# Altium schematic sheet 10_Power.SchDoc: Power (part 1 of 2)
size A3; Organization: Lime Microsystems; Address1: Surrey Tech Centre; Address2: Guildford GU2 7YG; Address3: Surrey; Address4: United Kingdom; Revision: v1.0; SheetNumber: 10; SheetTotal: 10
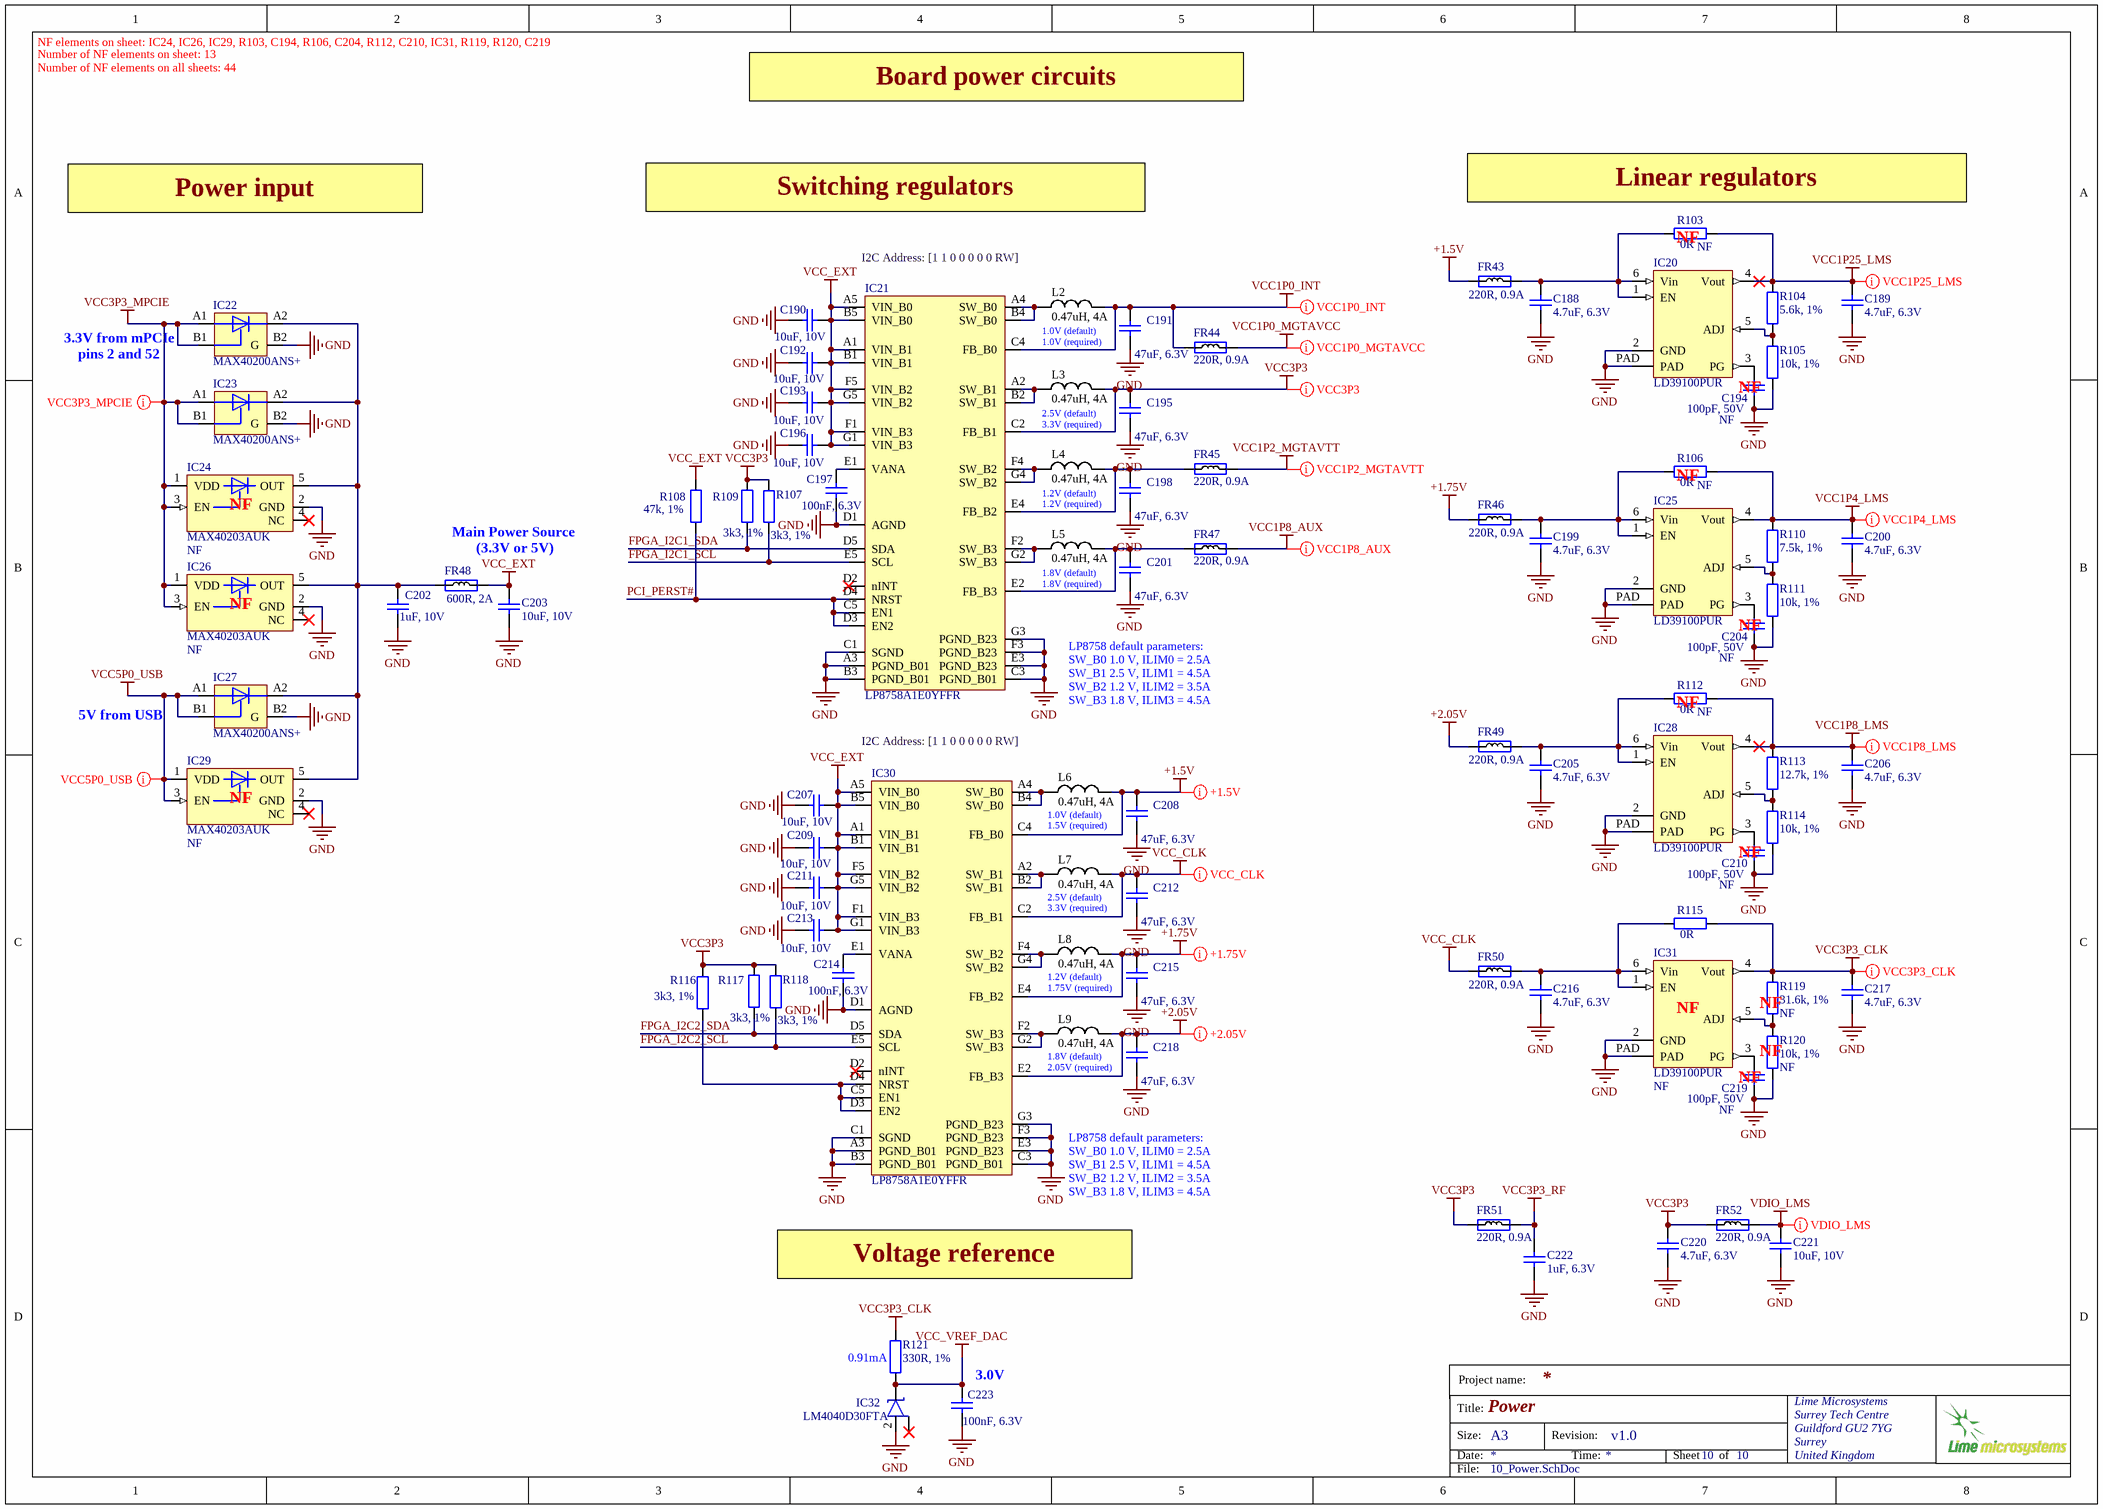
[diagram p0: 10_Power.SchDoc]

## Parts
C188  4.7uF, 6.3V  [CAP0402]
C189  4.7uF, 6.3V  [CAP0402]
C190  10uF, 10V  [CAP0603]
C191  47uF, 6.3V  [CAP0603]
C192  10uF, 10V  [CAP0603]
C193  10uF, 10V  [CAP0603]
C194  100pF, 50V  Assembly Info: NF  [CAP0201]
C195  47uF, 6.3V  [CAP0603]
C196  10uF, 10V  [CAP0603]
C197  100nF, 6.3V  [CAP0201]
C198  47uF, 6.3V  [CAP0603]
C199  4.7uF, 6.3V  [CAP0402]
C200  4.7uF, 6.3V  [CAP0402]
C201  47uF, 6.3V  [CAP0603]
C202  1uF, 10V  [CAP0402]
C203  10uF, 10V  [CAP0603]
C204  100pF, 50V  Assembly Info: NF  [CAP0201]
C205  4.7uF, 6.3V  [CAP0402]
C206  4.7uF, 6.3V  [CAP0402]
C207  10uF, 10V  [CAP0603]
C208  47uF, 6.3V  [CAP0603]
C209  10uF, 10V  [CAP0603]
C210  100pF, 50V  Assembly Info: NF  [CAP0201]
C211  10uF, 10V  [CAP0603]
C212  47uF, 6.3V  [CAP0603]
C213  10uF, 10V  [CAP0603]
C214  100nF, 6.3V  [CAP0201]
C215  47uF, 6.3V  [CAP0603]
C216  4.7uF, 6.3V  [CAP0402]
C217  4.7uF, 6.3V  [CAP0402]
C218  47uF, 6.3V  [CAP0603]
C219  100pF, 50V  Assembly Info: NF  [CAP0201]
C220  4.7uF, 6.3V  [CAP0402]
C221  10uF, 10V  [CAP0603]
C222  1uF, 6.3V  [CAP0201]
C223  100nF, 6.3V  [CAP0201]
FR43  220R, 0.9A  [RES0402]
FR44  220R, 0.9A  [RES0402]
FR45  220R, 0.9A  [RES0402]
FR46  220R, 0.9A  [RES0402]
FR47  220R, 0.9A  [RES0402]
FR48  600R, 2A  [RES0805]
FR49  220R, 0.9A  [RES0402]
FR50  220R, 0.9A  [RES0402]
FR51  220R, 0.9A  [RES0402]
FR52  220R, 0.9A  [RES0402]
IC20  LD39100PUR  [LD39100PUR]
IC21  LP8758A1E0YFFR  [LP8758A1E0YFFR_QUAD_DC-DC_35DSBGA]
IC22  MAX40200ANS+  [MAX40200ANS+_IDEAL_DIODE_4WLP]
IC23  MAX40200ANS+  [MAX40200ANS+_IDEAL_DIODE_4WLP]
IC24  MAX40203AUK  Assembly Info: NF  [SOT23-5_v1]
IC25  LD39100PUR  [LD39100PUR]
IC26  MAX40203AUK  Assembly Info: NF  [SOT23-5_v1]
IC27  MAX40200ANS+  [MAX40200ANS+_IDEAL_DIODE_4WLP]
IC28  LD39100PUR  [LD39100PUR]
IC29  MAX40203AUK  Assembly Info: NF  [SOT23-5_v1]
IC30  LP8758A1E0YFFR  [LP8758A1E0YFFR_QUAD_DC-DC_35DSBGA]
IC31  LD39100PUR  Assembly Info: NF  [LD39100PUR]
IC32  LM4040D30FTA  [LM4040D30FTA_VOLTAGE_REFERENCE_SOT23-3]
L2  0.47uH, 4A  [IND0806]
L3  0.47uH, 4A  [IND0806]
L4  0.47uH, 4A  [IND0806]
L5  0.47uH, 4A  [IND0806]
L6  0.47uH, 4A  [IND0806]
L7  0.47uH, 4A  [IND0806]
L8  0.47uH, 4A  [IND0806]
L9  0.47uH, 4A  [IND0806]
R103  0R  Assembly Info: NF  [RES0201]
R104  5.6k, 1%  [RES0201]
R105  10k, 1%  [RES0201]
R106  0R  Assembly Info: NF  [RES0201]
R107  3k3, 1%  [RES0201]
R108  47k, 1%  [RES0201]
R109  3k3, 1%  [RES0201]
R110  7.5k, 1%  [RES0201]
R111  10k, 1%  [RES0201]
R112  0R  Assembly Info: NF  [RES0201]
R113  12.7k, 1%  [RES0201]
R114  10k, 1%  [RES0201]
R115  0R  [RES0201]
R116  3k3, 1%  [RES0201]
R117  3k3, 1%  [RES0201]
R118  3k3, 1%  [RES0201]
R119  31.6k, 1%  Assembly Info: NF  [RES0201]
R120  10k, 1%  Assembly Info: NF  [RES0201]
R121  330R, 1%  [RES0201]

## Nets
+1.5V: C208.2 FR43.1 IC30.C4(FB_B0) L6.2
+1.75V: C215.2 FR46.1 IC30.E4(FB_B2) L8.2
+2.05V: C218.2 FR49.1 IC30.E2(FB_B3) L9.2
GND: C188.1 C189.1 C190.1 C191.1 C192.1 C193.1 C194.1 C195.1 C196.1 C197.2 C198.1 C199.1 C200.1 C201.1 C202.1 C203.1 C204.1 C205.1 C206.1 C207.1 C208.1 C209.1 C210.1 C211.1 C212.1 C213.1 C214.2 C215.1 C216.1 C217.1 C218.1 C219.1 C220.1 C221.1 C222.2 C223.2 IC20.2(GND) IC20.PAD IC21.A3(PGND_B01) IC21.B3(PGND_B01) IC21.C1(SGND) IC21.C3(PGND_B01) IC21.D1(AGND) IC21.E3(PGND_B23) IC21.F3(PGND_B23) IC21.G3(PGND_B23) IC22.B2(G) IC23.B2(G) IC24.2(GND) IC25.2(GND) IC25.PAD IC26.2(GND) IC27.B2(G) IC28.2(GND) IC28.PAD IC29.2(GND) IC30.A3(PGND_B01) IC30.B3(PGND_B01) IC30.C1(SGND) IC30.C3(PGND_B01) IC30.D1(AGND) IC30.E3(PGND_B23) IC30.F3(PGND_B23) IC30.G3(PGND_B23) IC31.2(GND) IC31.PAD IC32.2(A) R105.2 R111.2 R114.2 R120.2
VCC1P0_INT: C191.2 FR44.1 IC21.C4(FB_B0) L2.2
VCC1P0_MGTAVCC: FR44.2
VCC1P2_MGTAVTT: FR45.2
VCC1P4_LMS: C200.2 IC25.4(Vout) R106.2 R110.1
VCC1P8_AUX: FR47.2
VCC1P8_LMS: C206.2 IC28.4(Vout) R112.2 R113.1
VCC1P25_LMS: C189.2 IC20.4(Vout) R103.2 R104.1
VCC3P3: C195.2 C220.2 FR51.1 FR52.1 IC21.C2(FB_B1) L3.2 R107.1 R109.1 R116.1 R117.1 R118.1
VCC3P3_CLK: C217.2 IC31.4(Vout) R115.2 R119.1 R121.1
VCC3P3_MPCIE: IC22.A1(VDD) IC22.B1(EN) IC23.A1(VDD) IC23.B1(EN) IC24.1(VDD) IC24.3(EN) IC26.1(VDD) IC26.3(EN)
VCC3P3_RF: C222.1 FR51.2
VCC5P0_USB: IC27.A1(VDD) IC27.B1(EN) IC29.1(VDD) IC29.3(EN)
VCC_CLK: C212.2 FR50.1 IC30.C2(FB_B1) L7.2
VCC_EXT: C190.2 C192.2 C193.2 C196.2 C203.2 C207.2 C209.2 C211.2 C213.2 FR48.2 IC21.A1(VIN_B1) IC21.A5(VIN_B0) IC21.B1(VIN_B1) IC21.B5(VIN_B0) IC21.F1(VIN_B3) IC21.F5(VIN_B2) IC21.G1(VIN_B3) IC21.G5(VIN_B2) IC30.A1(VIN_B1) IC30.A5(VIN_B0) IC30.B1(VIN_B1) IC30.B5(VIN_B0) IC30.F1(VIN_B3) IC30.F5(VIN_B2) IC30.G1(VIN_B3) IC30.G5(VIN_B2) R108.1
VCC_VREF_DAC: C223.1 IC32.1(K) R121.2
VDIO_LMS: C221.2 FR52.2
FPGA_I2C1_SCL: IC21.E5(SCL) R107.2
FPGA_I2C1_SDA: IC21.D5(SDA) R109.2
FPGA_I2C2_SCL: IC30.E5(SCL) R118.2
FPGA_I2C2_SDA: IC30.D5(SDA) R117.2
PCI_PERST#: IC21.C5(EN1) IC21.D3(EN2) IC21.D4(NRST) R108.2
NetC188_2: C188.2 FR43.2 IC20.1(EN) IC20.6(Vin) R103.1
NetC194_2: C194.2 IC20.3(PG)
NetC197_1: C197.1 IC21.E1(VANA)
NetC198_2: C198.2 FR45.1 IC21.E4(FB_B2) L4.2
NetC199_2: C199.2 FR46.2 IC25.1(EN) IC25.6(Vin) R106.1
NetC201_2: C201.2 FR47.1 IC21.E2(FB_B3) L5.2
NetC202_2: C202.2 FR48.1 IC22.A2(OUT) IC23.A2(OUT) IC24.5(OUT) IC26.5(OUT) IC27.A2(OUT) IC29.5(OUT)
NetC204_2: C204.2 IC25.3(PG)
NetC205_2: C205.2 FR49.2 IC28.1(EN) IC28.6(Vin) R112.1
NetC210_2: C210.2 IC28.3(PG)
NetC214_1: C214.1 IC30.E1(VANA)
NetC216_2: C216.2 FR50.2 IC31.1(EN) IC31.6(Vin) R115.1
NetC219_2: C219.2 IC31.3(PG)
NetIC20_5: IC20.5(ADJ) R104.2 R105.1
NetIC21_A2: IC21.A2(SW_B1) IC21.B2(SW_B1) L3.1
NetIC21_A4: IC21.A4(SW_B0) IC21.B4(SW_B0) L2.1
NetIC21_F2: IC21.F2(SW_B3) IC21.G2(SW_B3) L5.1
NetIC21_F4: IC21.F4(SW_B2) IC21.G4(SW_B2) L4.1
NetIC25_5: IC25.5(ADJ) R110.2 R111.1
NetIC28_5: IC28.5(ADJ) R113.2 R114.1
NetIC30_A2: IC30.A2(SW_B1) IC30.B2(SW_B1) L7.1
NetIC30_A4: IC30.A4(SW_B0) IC30.B4(SW_B0) L6.1
NetIC30_C5: IC30.C5(EN1) IC30.D3(EN2) IC30.D4(NRST) R116.2
NetIC30_F2: IC30.F2(SW_B3) IC30.G2(SW_B3) L9.1
NetIC30_F4: IC30.F4(SW_B2) IC30.G4(SW_B2) L8.1
NetIC31_5: IC31.5(ADJ) R119.2 R120.1

Not connected (* = marked no-connect by the designer): IC21 D2(nINT)*; IC24 4(NC)*; IC26 4(NC)*; IC29 4(NC)*; IC30 D2(nINT)*; IC32 3(NC/A)*

## Layout directives
net class VDIO_LMS: VDIO_LMS
net class VCC1P25_LMS: VCC1P25_LMS
net class VCC1P4_LMS: VCC1P4_LMS
net class VCC1P8_LMS: VCC1P8_LMS
net class VCC3P3_CLK: VCC3P3_CLK
net class +1.5V: +1.5V, +2.05V
net class VCC_CLK: VCC_CLK
net class +1.75V: +1.75V
net class VCC1P8_AUX: VCC1P8_AUX
net class VCC1P2_MGTAVTT: VCC1P2_MGTAVTT
net class VCC3P3: VCC3P3
net class VCC1P0_MGTAVCC: VCC1P0_MGTAVCC
net class VCC1P0_INT: VCC1P0_INT
net class VCC3P3_MPCIE: VCC3P3_MPCIE
net class VCC5P0_USB: VCC5P0_USB

## Notes on the sheet
- NF elements on sheet: IC24, IC26, IC29, R103, C194, R106, C204, R112, C210, IC31, R119, R120, C219
- Number of NF elements on sheet: 13
- Number of NF elements on all sheets: 44
- Board power circuits
- Power input
- Switching regulators
- (near R103) Linear regulators
- (near R103) NF
- I2C Address: [1 1 0 0 0 0 0 RW]
- 3.3V from mPCIe pins 2 and 52
- 1.0V (default)
  1.0V (required)
- 2.5V (default)
  3.3V (required)
- NF
- (near IC24) NF
- 1.2V (default)
  1.2V (required)
- (near R106) NF
- (near FR48) Main Power Source
  (3.3V or 5V)
- 1.8V (default)
  1.8V (required)
- (near IC26) NF
- LP8758 default parameters:
  SW_B0 1.0 V, ILIM0 = 2.5A
  SW_B1 2.5 V, ILIM1 = 4.5A
  SW_B2 1.2 V, ILIM2 = 3.5A
  SW_B3 1.8 V, ILIM3 = 4.5A
- (near R112) NF
- 5V from USB
- (near IC29) NF
- 1.0V (default)
  1.5V (required)
- 1.2V (default)
  1.75V (required)
- (near IC31) NF
- (near R120) NF
- (near R119) NF
- 1.8V (default)
  2.05V (required)
- Voltage reference
- (near R121) 0.91mA
- (near C223) 3.0V
- Project name:
- Title:
- Size:
- Date:
- A3
- Revision:
- Time:
- Sheet
- of
- File: